# EAGLE design RH003.1 (EAGLE 7.1.0)
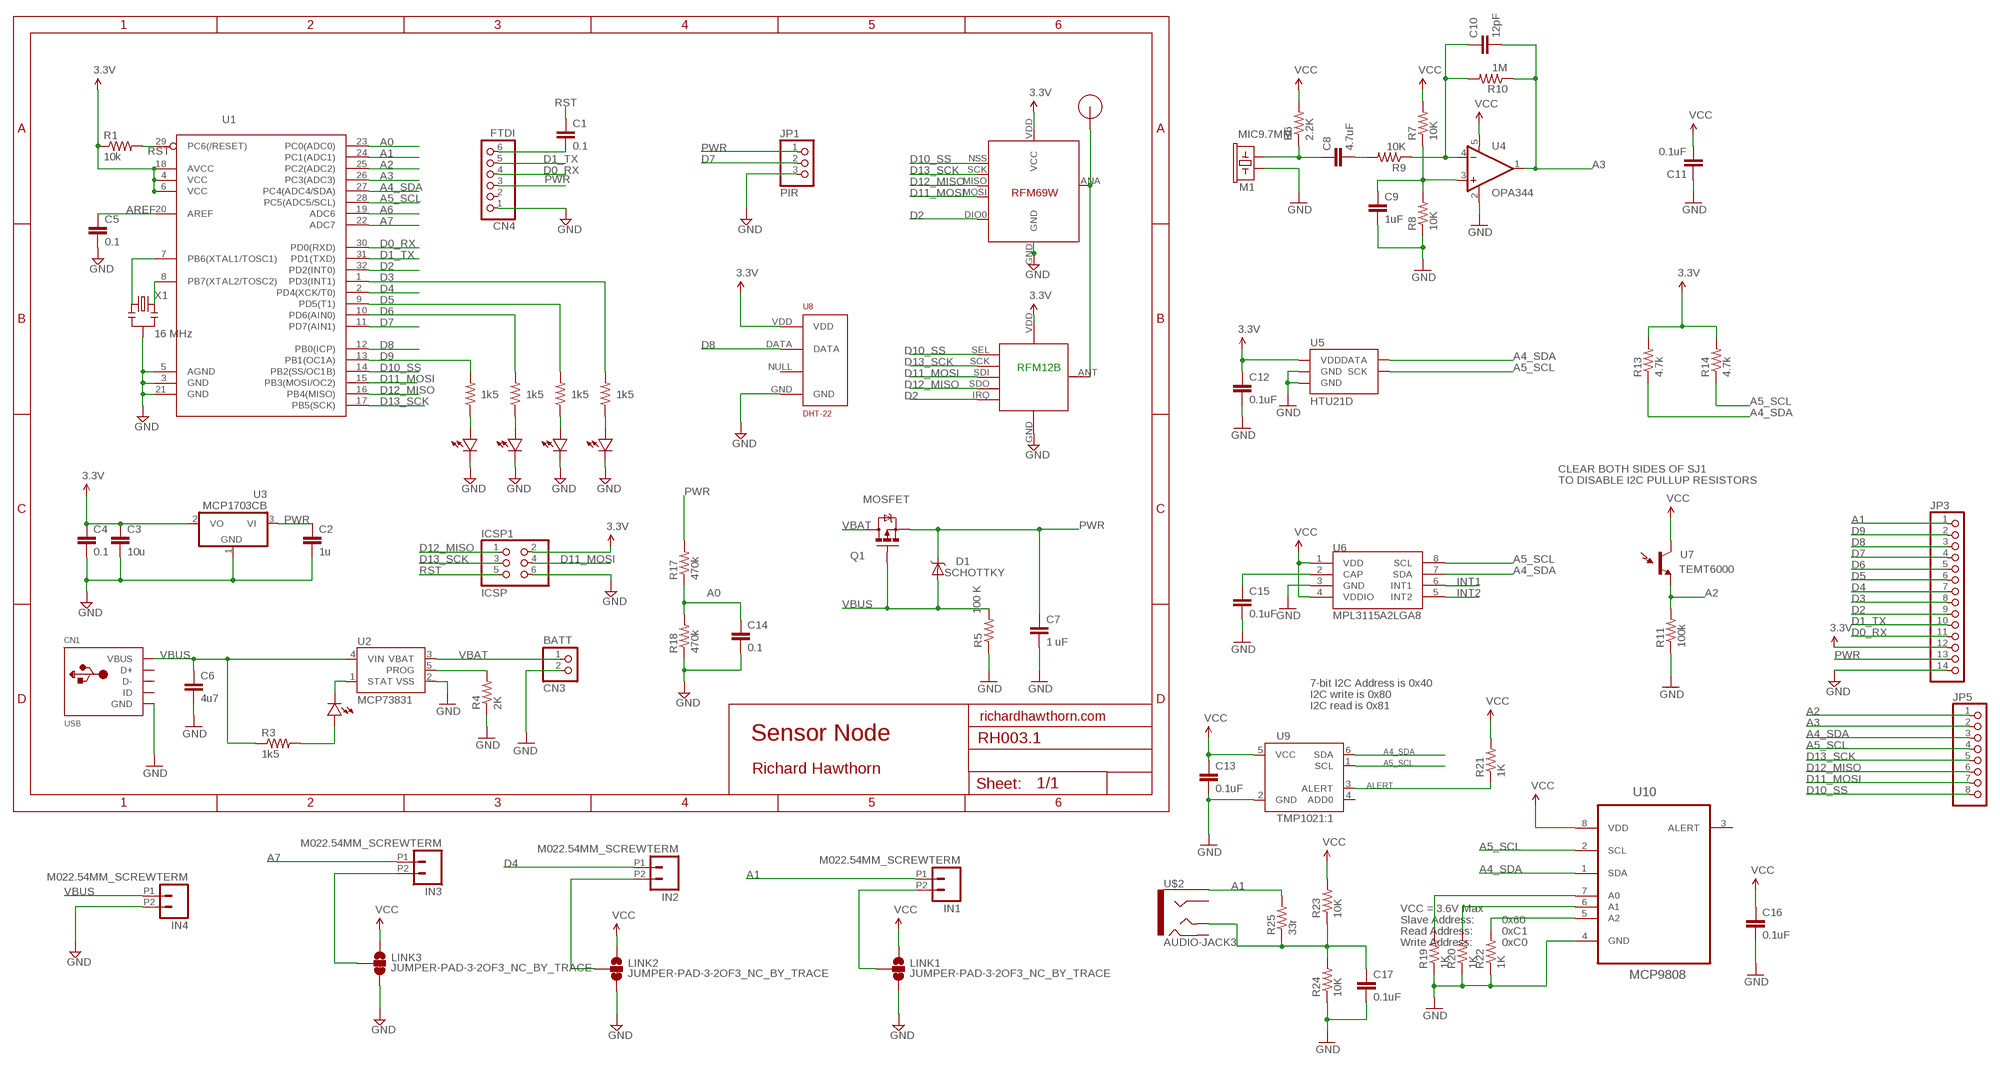
[diagram p0: schematic, sheet 1]

## Parts
C1  0.1  CAP0603-CAP  [0603-CAP]
C2  1u  CAP0603-CAP  [0603-CAP]
C3  10u  CAP0805-CAP  [0805-CAP]
C4  0.1  CAP0603-CAP  [0603-CAP]
C5  0.1  CAP0603-CAP  [0603-CAP]
C6  4u7  CAP0603-CAP  [0603-CAP]
C7  1 uF  CAP0805  [0805]
C8  4.7uF  CAP0805  [0805]
C9  1uF  CAP0805  [0805]
C10  12pF  CAP0805  [0805]
C11  0.1uF  CAP0805  [0805]
C12  0.1uF  CAP0805  [0805]
C13  0.1uF  CAP0603-CAP  [0603-CAP]
C14  0.1  CAP0603-CAP  [0603-CAP]
C15  0.1uF  CAP0805  [0805]
C16  0.1uF  CAP0603-CAP  [0603-CAP]
C17  0.1uF  CAP0603-CAP  [0603-CAP]
CN1  USB  USBMINIB  [USB-MINIB]
CN3  BATT  JST_2PIN-SMT-RA  [JST-PH-2-SMT-RA]
CN4  FTDI  PINHD-1X6  [1X06]
D1  SCHOTTKY  DIODE-SCHOTTKY_  [SMA-DIODE]
ICSP1  ICSP  PINHD-2X3  [2X03]
IN1  M022.54MM_SCREWTERM  [1X02_2.54_SCREWTERM]
IN2  M022.54MM_SCREWTERM  [1X02_2.54_SCREWTERM]
IN3  M022.54MM_SCREWTERM  [1X02_2.54_SCREWTERM]
IN4  M022.54MM_SCREWTERM  [1X02_2.54_SCREWTERM]
JP1  PIR  PINHD-1X3  [1X03]
JP3  PINHD-1X14  [1X14]
JP5  PINHD-1X8  [1X08]
LED1  LED0603  [0603-LED]
LED2  LED0603  [0603-LED]
LED3  LED0603  [0603-LED]
LED4  LED0603  [0603-LED]
LED5  LED0603  [0603-LED]
LINK1  JUMPER-PAD-3-2OF3_NC_BY_TRACE  [PAD-JUMPER-3-2OF3_NC_BY_TRACE_YES_SILK_FULL_BOX]
LINK2  JUMPER-PAD-3-2OF3_NC_BY_TRACE  [PAD-JUMPER-3-2OF3_NC_BY_TRACE_YES_SILK_FULL_BOX]
LINK3  JUMPER-PAD-3-2OF3_NC_BY_TRACE  [PAD-JUMPER-3-2OF3_NC_BY_TRACE_YES_SILK_FULL_BOX]
M1  MIC9.7MM  [MIC-9.7MM]
Q1  MOSFET  MOSFET-PCHANNELSMD  [SOT23-3]
R1  10k  RESISTOR0603-RES  [0603-RES]
R2  1k5  RESISTOR0805  [0805]
R3  1k5  RESISTOR0603-RES  [0603-RES]
R4  2K  RESISTOR0603-RES  [0603-RES]
R5  100 K  RESISTOR0805-RES  [0805]
R6  2.2K  RESISTOR0805-RES  [0805]
R7  10K  RESISTOR0805-RES  [0805]
R8  10K  RESISTOR0805-RES  [0805]
R9  10K  RESISTOR0805-RES  [0805]
R10  1M  RESISTOR0805-RES  [0805]
R11  100k  RESISTOR0603-RES  [0603-RES]
R12  1k5  RESISTOR0805  [0805]
R13  4.7k  RESISTOR0805-RES  [0805]
R14  4.7k  RESISTOR0805-RES  [0805]
R15  1k5  RESISTOR0805  [0805]
R16  1k5  RESISTOR0805  [0805]
R17  470k  RESISTOR0603-RES  [0603-RES]
R18  470k  RESISTOR0603-RES  [0603-RES]
R19  1K  RESISTOR0603-RES  [0603-RES]
R20  1K  RESISTOR0603-RES  [0603-RES]
R21  1K  RESISTOR0603-RES  [0603-RES]
R22  1K  RESISTOR0603-RES  [0603-RES]
R23  10K  RESISTOR0603-RES  [0603-RES]
R24  10K  RESISTOR0603-RES  [0603-RES]
R25  33r  RESISTOR0603-RES  [0603-RES]
RF1  RFM12B  RFM12B_MINPADS  [RFM12B-MINPADS]
RF2  RFM69  [RFM69W-MINPADS]
U1  ATMega-328  ATMEGA168/328TQFP32  [TQFP32-08]
U2  MCP73831  [SOT23-5]
U3  MCP1703CB  [SOT23]
U4  OPA344  [SOT23-5]
U5  HTU21D  HTU21DSMD  [HTU21D]
U6  MPL3115A2LGA8  [LGA8]
U7  TEMT6000  [TEMT6000-SEN]
U8  DHT-22  RHT03_DHT-22_AM2302RA  [RHT03_DHT-22/RA]
U9  TMP1021:1  [SOT563-2]
U10  MCP9808  MCP9808-E/MS  [SOP65P490X110-8N]
U$1  RFM12B_ANTENNA  [RFM12B-ANTENNA]
U$2  AUDIO-JACK3  [AUDIO-JACK-TRRS-SMD]
X1  16 MHz  RESONATORSMD  [RESONATOR-SMD]

## Nets
3.3V: C3.1 C4.1 C11.2 C12.1 C13.1 C16.1 ICSP1.2 JP3.12 LINK1.1 LINK2.1 LINK3.1 R1.1 R6.2 R7.2 R13.2 R14.2 R21.2 R23.2 RF1.VDD RF2.VDD(VCC) U1.4(VCC) U1.6(VCC) U1.18(AVCC) U3.2(VO) U4.5(V+) U5.VDD U6.1(VDD) U6.4(VDDIO) U7.COLLECTOR(C1) U8.VDD U9.5(VCC) U10.8(VDD) ; supply symbol labelled VCC
A0: C14.1 R17.1 R18.2 U1.23(PC0(ADC0))
A1: IN1.P1 JP3.1 R25.2 U1.24(PC1(ADC1)) U$2.EARTH
A2: JP5.1 R11.2 U1.25(PC2(ADC2)) U7.EMITTER(E1)
A3: C10.2 JP5.2 R10.1 U1.26(PC3(ADC3)) U4.1(OUT)
A4_SDA: JP5.3 R13.1 U1.27(PC4(ADC4/SDA)) U5.DATA U6.7(SDA) U9.6(SDA) U10.1(SDA)
A5_SCL: JP5.4 R14.1 U1.28(PC5(ADC5/SCL)) U5.SCK U6.8(SCL) U9.1(SCL) U10.2(SCL)
A6: U1.19(ADC6)
A7: IN3.P1 U1.22(ADC7)
ALERT: R21.1 U9.3(ALERT)
AREF: C5.1 U1.20(AREF)
D0_RX: CN4.4 JP3.11 U1.30(PD0(RXD))
D1_TX: CN4.5 JP3.10 U1.31(PD1(TXD))
D2: JP3.9 RF1.IRQ RF2.DIO0 U1.32(PD2(INT0))
D3: JP3.8 R16.2 U1.1(PD3(INT1))
D4: IN2.P1 JP3.7 U1.2(PD4(XCK/T0))
D5: JP3.6 R15.2 U1.9(PD5(T1))
D6: JP3.5 R12.2 U1.10(PD6(AIN0))
D7: JP1.2 JP3.4 U1.11(PD7(AIN1))
D8: JP3.3 U1.12(PB0(ICP)) U8.DATA
D9: JP3.2 R2.2 U1.13(PB1(OC1A))
D10_SS: JP5.8 RF1.SEL RF2.NSS(SEL) U1.14(PB2(SS/OC1B))
D11_MOSI: ICSP1.4 JP5.7 RF1.SDI(SDI/MOSI) RF2.MOSI U1.15(PB3(MOSI/OC2))
D12_MISO: ICSP1.1 JP5.6 RF1.SDO(SDO/MISO) RF2.MISO U1.16(PB4(MISO))
D13_SCK: ICSP1.3 JP5.5 RF1.SCK RF2.SCK U1.17(PB5(SCK))
GND [power]: C2.2 C3.2 C4.2 C5.2 C6.2 C7.2 C9.2 C11.1 C12.2 C13.2 C14.2 C15.2 C16.2 C17.2 CN1.GND CN3.2 CN4.1 ICSP1.6 IN4.P2 JP1.3 JP3.14 LED2.MINUS LED3.MINUS LED4.MINUS LED5.MINUS LINK1.3 LINK2.3 LINK3.3 M1.2 R4.1 R5.1 R8.1 R11.1 R18.1 R19.1 R20.1 R22.1 R24.1 RF1.GND RF2.GND U1.3(GND) U1.5(AGND) U1.21(GND) U2.2(VSS) U3.1(GND) U4.2(V-) U5.7(GND) U5.GND U6.3(GND) U8.GND U9.2(GND) U10.4(GND) X1.2
INT1: U6.6(INT1)
INT2: U6.5(INT2)
N$1: U1.7(PB6(XTAL1/TOSC1)) X1.1
N$2: LED2.PLUS R2.1
N$3: RF1.ANT RF2.ANA(ANT) U$1.P$1
N$4: LED1.PLUS R3.2
N$5: C8.1 M1.1 R6.1
N$6: C10.1 R9.1 R10.2 U4.4(-IN)
N$7: C8.2 R9.2
N$8: C9.1 R7.1 R8.2 U4.3(+IN)
N$9: C15.1 U6.2(CAP)
N$10: LED3.PLUS R12.1
N$11: LED4.PLUS R15.1
N$12: LED5.PLUS R16.1
N$13 [power]: IN1.P2 LINK1.2
N$14: C17.1 R23.1 R24.2 R25.1 U$2.TIP
N$15 [power]: IN2.P2 LINK2.2
N$16: R22.2 U10.5(A2)
N$17: R20.2 U10.6(A1)
N$18: R19.2 U10.7(A0)
N$19 [power]: IN3.P2 LINK3.2
N$20: C1.2 CN4.6
N$21: U1.8(PB7(XTAL2/TOSC2)) X1.3
PROG: R4.2 U2.5(PROG)
PWR [power]: C2.1 C7.1 CN4.3 D1.C JP1.1 JP3.13 Q1.2(S) R17.2 U3.3(VI)
RST: C1.1 ICSP1.5 R1.2 U1.29(PC6(/RESET))
STAT: LED1.MINUS U2.1(STAT)
VBAT: CN3.1 Q1.3(D) U2.3(VBAT)
VBUS [power]: C6.1 CN1.VBUS D1.A IN4.P1 Q1.1(G) R3.1 R5.2 U2.4(VIN)
Unconnected: CN1.D+ CN1.D- CN1.ID CN4.2 U8.NULL U9.4(ADD0) U10.3(ALERT) U$2.RING1 U$2.RING2

## Notes on the sheet
- RFM12B
- CLEAR BOTH SIDES OF SJ1
- TO DISABLE I2C PULLUP RESISTORS
- 7-bit I2C Address is 0x40
- I2C write is 0x80
- I2C read is 0x81
- richardhawthorn.com
- Sensor Node
- Richard Hawthorn
- VCC = 3.6V Max
- Slave Address: | 0x60
- Read Address: | 0xC1
- Write Address: | 0xC0

## Library data of the parts
C1-C5 C14 = LowPowerLab:CAP: Capacitor Standard 0603 ceramic capacitor, and 0.1" leaded capacitor.
C6 C8-C13 C15-C17 = SparkFun:CAP: Capacitor Standard 0603 ceramic capacitor, and 0.1" leaded capacitor.
C7 = SparkFun-Capacitors:CAP: Capacitor Standard 0603 ceramic capacitor, and 0.1" leaded capacitor.
CN1 = LowPowerLab:USB: USB Connectors USBMINIB - Surface Mount Female Mini-B USB Connector 4UConnector: 06564 By microbuilder.eu Thru-hole RA Female Mini-B USB Connector 4UConnector: 18732 By ladyada.net
CN3 = adafruit:JST_2PIN: JST 2-Pin Connectors of various flavors SMT-RA (S2B-PH-SM4) 4UConnector #17311 SMT (B2B-PH-SM4) THM-RA (S2B-PH) THM (B2B-PH)
CN4 = pinhead:PINHD-1X6: PIN HEADER
D1 = SparkFun-DiscreteSemi:DIODE-SCHOTTKY: Commonly MBRA140.
ICSP1 = pinhead:PINHD-2X3: PIN HEADER
IN1-IN4 = SparkFun-Connectors:M02: Standard 2-pin 0.1" header. Use with - straight break away headers ( PRT-00116) - right angle break away headers (PRT-00553) - swiss pins (PRT-00743) - machine pins (PRT-00117) - female headers (PRT-00115) Molex polarized connector foot print use with: PRT-08233 with associated crimp pins and housings. 2.54_SCREWTERM for use with PRT-10571. 3.5mm Screw Terminal footprints for PRT-08084 5mm Screw Terminal footprints for use with PRT-08432
JP1 = pinhead:PINHD-1X3: PIN HEADER
JP3 = pinhead:PINHD-1X14: PIN HEADER
JP5 = pinhead:PINHD-1X8: PIN HEADER
LED1-LED5 = LowPowerLab:LED
LINK1-LINK3 = SparkFun-Passives:JUMPER-PAD-3-2OF3_NC_BY_TRACE
M1 = SparkFun:MIC: Microphone Omni-directional electret microphone. 9.7mm standard diameter.
Q1 = SparkFun-DiscreteSemi:MOSFET-PCHANNEL: Generic PMOSFET
R1-R4 R12 R15-R18 = LowPowerLab:RESISTOR: Resistor Basic schematic elements and footprints for 0603, 1206, and PTH resistors.
R5 = SparkFun-Resistors:RESISTOR: Resistor Basic schematic elements and footprints for 0603, 1206, and PTH resistors.
R6-R11 R13 R14 R19-R25 = SparkFun:RESISTOR: Resistor Basic schematic elements and footprints for 0603, 1206, and PTH resistors.
RF1 = LowPowerLab:RFM12B_MINPADS
RF2 = LowPowerLab:RFM69
U1 = LowPowerLab:ATMEGA168/328: Atmel 32-pin 8-bit micro, 16k flash.
U2 = SparkFun:MCP73831: Microchip's MCP73831 Miniature single cell, fully integrated Li-Ion, Li-polymer charge management controller http://ww1.microchip.com/downloads/en/DeviceDoc/21984a.pdf
U3 = linear:MCP1703: 250 mA, 16V, Low Quiescent Current LDO Regulator Source: http://ww1.microchip.com/downloads/en/DeviceDoc/22049b.pdf
U4 = SparkFun:OPA344
U5 = SparkFun-Sensors:HTU21D
U6 = SparkFun-Sensors:MPL3115A2: Altimeter/Pressure Sensor, I2C, 1.95V-3.6V supply, 50 to 110kPa
U7 = SparkFun:TEMT6000: Ambient Light Sensor Simple light detection sensor. Output varies with light intensity input. Spark Fun Electronics SKU : COM-08348
U8 = RHT03_DHT-22_AM2302:RHT03_DHT-22_AM2302: RHT03 / DHT-22 / AM2302 Packages and symbol for the RHT03 / DHT-22 relative humidity and temperature sensor. Note: The AM2302 is a wired version of the DHT-22 which typically requires less clearance and is thus provided as a separate package.; PROD_ID: SEN-10167
U9 = SparkFun-Sensors:TMP102: I2C degC temp sensor
U10 = Richard1:MCP9808-E/MS: Digital Temperature Sensor,MSOP-8; MPN: MCP9808-E/MS; OC_FARNELL: 2080523; OC_NEWARK: 89T8871; PACKAGE: MSOP-8; SUPPLIER: MICROCHIP
U$1 = LowPowerLab:RFM12B_ANTENNA
U$2 = SparkFun-Connectors:AUDIO-JACK3: Audio jack - 3.5mm TRRS variety - two rings.
X1 = SparkFun:RESONATOR: Resonator Small SMD resonator. This is the itty bitty 10/20MHz resonators with built in caps. CSTCE10M0G55 and CSTCE20M0V53. Footprint has been reviewed closely but hasn't been tested yet.

## Net classes
1 power: width 0.381 mm, clearance 0.254 mm

## Board
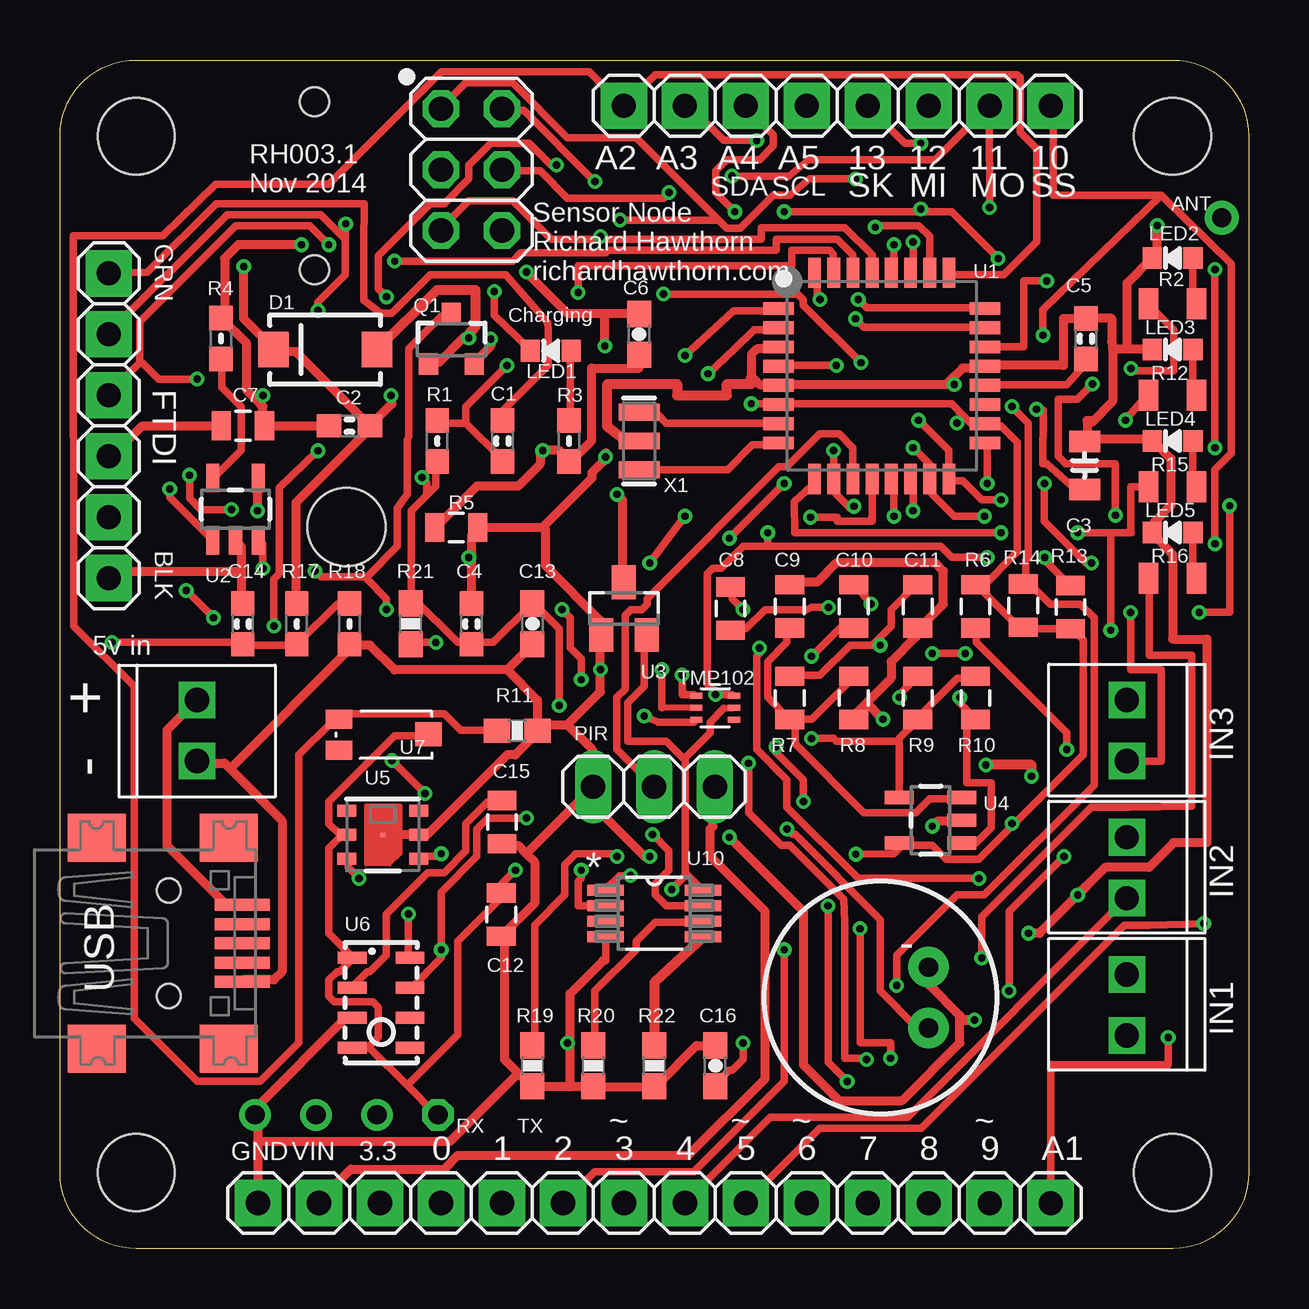
[diagram p1: board, top side]
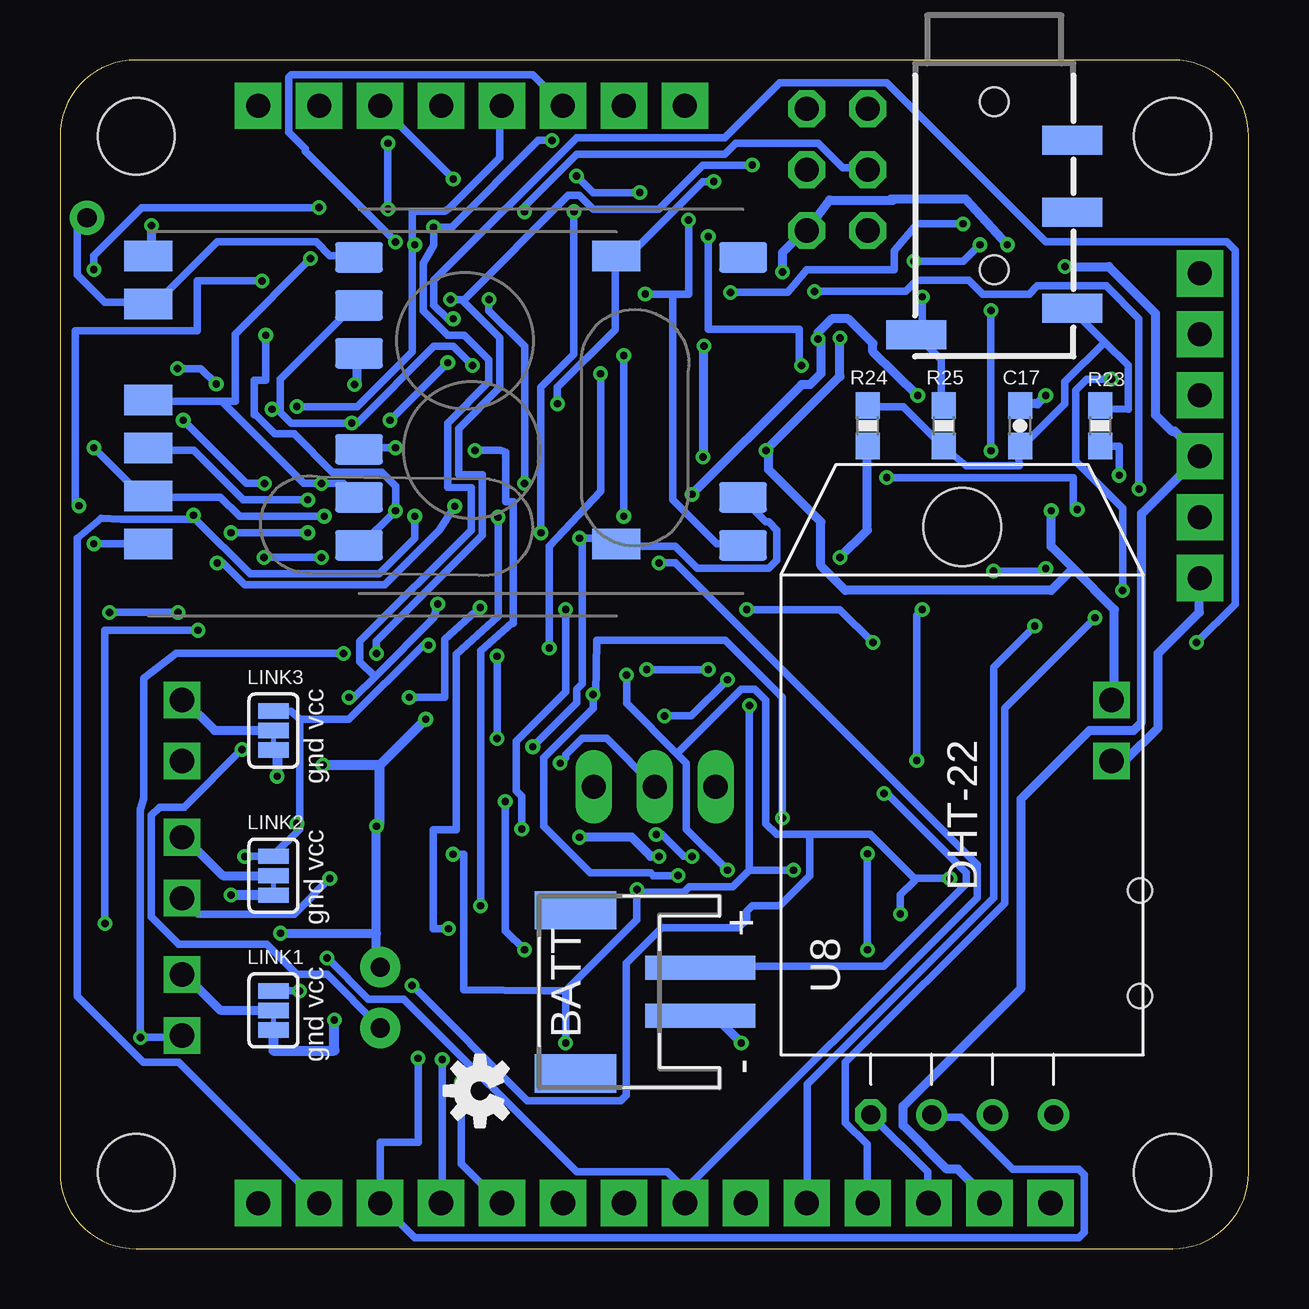
[diagram p2: board, bottom side, seen from below]

Size 49.53 x 49.53 mm. Coordinates in mm from the lower left corner, seen from the top.
Outline: 0,3.17 0,46.35 arc-90 3.17,49.53 46.35,49.53 arc-90 49.53,46.35 49.53,3.17 arc-90 46.35,0 3.17,0 arc-90 0,3.17
Copper layers (1*16): Top 0.035mm / dielectric 1.5mm / Bottom 0.035mm
Design rules "ITEADstudio_DRC *": minimum track width 12mil, minimum drill 12mil, track to track 6mil, track to pad 6mil, pad to pad 6mil, via to via 6mil, smd to smd 0mil, copper to edge 10mil, drill to drill 10mil, minimum pad ring 10mil, minimum via ring 6mil, stop-mask expansion 2mil, vias tented up to drill 100mil, thermal gap 15mil
Holes 3.2 mm at 3.17,3.17 46.35,3.17 3.17,46.35 46.35,46.35
tKeepout: area 0,0 to 5.7,5.7; area 43.8,0 to 49.5,5.7; area 43.8,43.8 to 49.5,49.5; area 0,43.8 to 5.7,49.5
bKeepout: area 0,43.8 to 5.7,49.5; area 43.8,43.8 to 49.5,49.5; area 43.8,0 to 49.5,5.7; area 0,0 to 5.7,5.7
tRestrict: area 24.3,8.9 to 29.1,12.8; area 5.8,16.9 to 6.9,18.5; area 5.2,9.7 to 6.7,10.4
bRestrict: area 27.4,17.7 to 29.2,18.7; area 21.1,13.8 to 22.9,14.9; area 21.6,12.6 to 22.1,13.2; area 20.7,12.6 to 21.2,13.2; area 20.2,12.8 to 20.7,13.5; area 20.1,13.4 to 20.6,14; area 26.5,18.9 to 27.1,19.5; area 26.5,17.9 to 27.1,18.5; area 27.5,19.1 to 28,19.8; area 27.9,18.8 to 29.1,19.6

### Footprints (pad centres in the part's own frame; a part is rotated, then mirrored left to right if it is on the bottom)
0603-CAP = smd 1.016 x 0.965: 1 -0.85,0; 2 0.85,0
0805-CAP = smd 0.902 x 1.3: 1 -1,0; 2 1,0
0603-CAP' = smd 1.1 x 1: 1 -0.85,0; 2 0.85,0
0805 = smd 0.8 x 1.2: 1 -0.9,0; 2 0.9,0
USB-MINIB = smd 0.5 x 2.308: D+ 0,4.064; D- -0.8,4.064; GND 1.6,4.064; ID 0.8,4.064; VBUS -1.6,4.064 | smd 2 x 2.4: GND1 -4.4,-2; GND2 -4.4,3.5; GND3 4.4,3.5; GND4 4.4,-2 | hole 1: -2.2,1; 2.2,1
JST-PH-2-SMT-RA = smd 1 x 4.6: 1 1,-3.7; 2 -1,-3.7 | smd 1.6 x 3.4: NC1 -3.4,1.5; NC2 3.4,1.5
1X06 = drill 1 pad 1.93 square: 1 -6.35,0; 2 -3.81,0; 3 -1.27,0; 4 1.27,0; 5 3.81,0; 6 6.35,0
SMA-DIODE = smd 1.27 x 1.47: A -2.15,0; C 2.15,0
2X03 = drill 1.016 octagon: 1 -2.54,-1.27; 2 -2.54,1.27; 3 0,-1.27; 4 0,1.27; 5 2.54,-1.27; 6 2.54,1.27
1X02_2.54_SCREWTERM = drill 1.016 square: P1 2.54,0; P2 0,0
1X03 = drill 1.016 long: 1 -2.54,0; 2 0,0; 3 2.54,0
1X14 = drill 1 pad 1.93 square: 1 -16.51,0; 2 -13.97,0; 3 -11.43,0 | drill 1.016 pad 1.93 square: 4 -8.89,0; 5 -6.35,0; 6 -3.81,0; 7 -1.27,0; 8 1.27,0; 9 3.81,0; 10 6.35,0; 11 8.89,0; 12 11.43,0; 13 13.97,0; 14 16.51,0
1X08 = drill 1 pad 1.93 square: 1 -8.89,0; 2 -6.35,0; 3 -3.81,0; 4 -1.27,0; 5 1.27,0; 6 3.81,0; 7 6.35,0; 8 8.89,0
0603-LED = smd 0.8 x 0.9: MINUS -0.85,0; PLUS 0.85,0
PAD-JUMPER-3-2OF3_NC_BY_TRACE_YES_SILK_FULL_BOX = smd 0.635 x 1.27: 1 -0.813,0; 2 0,0; 3 0.813,0
MIC-9.7MM = drill 0.8 pad 1.676: 1 -2,1.27; 2 -2,-1.27
SOT23-3 = smd 0.8 x 0.9: 1 -0.95,-1; 2 0.95,-1; 3 0,1.1
0603-RES = smd 1.016 x 0.965: 1 -0.85,0; 2 0.85,0
0805' = smd 0.8 x 1.3: 1 -1,0; 2 1,0
0603-RES' = smd 1.1 x 1: 1 -0.85,0; 2 0.85,0
RFM12B-MINPADS = smd 2 x 1.27: ANT 8,-6; GND 8,-2; IRQ -8,4; SCK 8,4; SDI 8,2; SDI1 -8.002,-6.001; SDO -8,6; SEL 8,6; VDD 8,-4
RFM69W-MINPADS = smd 2 x 1.27: ANA 8,-5; DIO0 -11.5,5; GND 8,-7; MISO 8,1; MOSI 8,3; NSS 8,5; SCK 8,-1; VDD -11.5,-7
TQFP32-08 = smd 1.27 x 0.533: 1 -4.293,2.8; 2 -4.293,2; 3 -4.293,1.2; 4 -4.293,0.4; 5 -4.293,-0.4; 6 -4.293,-1.2; 7 -4.293,-2; 8 -4.293,-2.8; 17 4.293,-2.8; 18 4.293,-2; 19 4.293,-1.2; 20 4.293,-0.4; 21 4.293,0.4; 22 4.293,1.2; 23 4.293,2; 24 4.293,2.8 | smd 0.533 x 1.27: 9 -2.8,-4.293; 10 -2,-4.293; 11 -1.2,-4.293; 12 -0.4,-4.293; 13 0.4,-4.293; 14 1.2,-4.293; 15 2,-4.293; 16 2.8,-4.293; 25 2.8,4.293; 26 2,4.293; 27 1.2,4.293; 28 0.4,4.293; 29 -0.4,4.293; 30 -1.2,4.293; 31 -2,4.293; 32 -2.8,4.293
SOT23-5 = smd 0.55 x 1.2: 1 -0.95,-1.3; 2 0,-1.3; 3 0.95,-1.3; 4 0.95,1.3; 5 -0.95,1.3
SOT23 = smd 1 x 1.4: 1 -0.95,-1.1; 2 0.95,-1.1; 3 0,1.1
HTU21D = smd 0.2 x 0.2: 7 0,0 | smd 0.8 x 0.5: DATA 1.5,-1; GND 1.5,0; NC@1 -1.5,1; NC@6 1.5,1; SCK -1.5,-1; VDD -1.5,0
LGA8 = smd 1.2 x 0.5: 1 -1.2,1.875; 2 -1.2,0.625; 3 -1.2,-0.625; 4 -1.2,-1.875; 5 1.2,-1.875; 6 1.2,-0.625; 7 1.2,0.625; 8 1.2,1.875
TEMT6000-SEN = smd 1.1 x 0.8: BASE -1.87,-0.65; EMITTER -1.87,0.65 | smd 1.1 x 1: COLLECTOR 1.86,0.01
RHT03_DHT-22/RA = drill 0.8: DATA -1.27,0; GND 3.81,0; NULL 1.27,0 | drill 0.8 octagon: VDD -3.81,0 | hole 3.25: 0,24.5
SOT563-2 = smd 0.508 x 0.249: 1 -0.8,0.498; 2 -0.8,0.003; 3 -0.8,-0.506; 4 0.776,-0.506; 5 0.776,0.003; 6 0.776,0.498
SOP65P490X110-8N = smd 1.524 x 0.457: 1 -2.032,0.965; 2 -2.032,0.33; 3 -2.032,-0.33; 4 -2.032,-0.965; 5 2.032,-0.965; 6 2.032,-0.33; 7 2.032,0.33; 8 2.032,0.965
RFM12B-ANTENNA = drill 0.8 pad 1.422: P$1 0,0
AUDIO-JACK-TRRS-SMD = smd 1.2 x 2.5: EARTH 11.3,-3.25; RING1 6.2,3.25; RING2 3.2,3.25; TIP 10.2,3.25 | hole 1.2: 1.6,0; 8.6,0
RESONATOR-SMD = smd 0.7 x 1.7: 1 -1.2,0; 2 0,0; 3 1.2,0

### Placement (x,y rotation side)
C1  18.44,33.66 90 top
C2  12.06,34.29 180 top
C3  42.7,32.64 90 top
C4  17.14,26.04 90 top
C5  42.75,37.92 90 top
C6  4u7  [0603-CAP']  24.13,38.1 90 top
C7  7.62,34.29 0 top
C8  27.94,26.67 270 top
C9  30.4,26.76 90 top
C10  33.07,26.76 90 top
C11  35.73,26.76 90 top
C12  18.38,13.92 270 top
C13  0.1uF  [0603-CAP']  19.68,26.04 270 top
C14  7.62,26.04 90 top
C15  18.41,17.78 270 top
C16  0.1uF  [0603-CAP']  27.3,7.62 90 top
C17  0.1uF  [0603-CAP']  9.53,34.29 90 bottom
CN1  3.53,12.73 270 top
CN3  26.55,10.7 90 bottom
CN4  2.03,34.29 90 top
D1  11.05,37.47 180 top
ICSP1  17.14,44.96 270 top
IN1  44.45,11.43 270 top
IN2  44.45,17.14 270 top
IN3  44.45,22.86 270 top
IN4  5.71,20.32 90 top
JP1  24.75,19.25 180 top
JP3  24.77,1.91 180 top
JP5  32.38,47.62 0 top
LED1  20.45,37.41 0 top
LED2  46.35,41.27 0 top
LED3  46.35,37.47 0 top
LED4  46.35,33.66 0 top
LED5  46.35,29.84 0 top
LINK1  40.64,9.93 270 bottom
LINK2  40.64,15.54 270 bottom
LINK3  40.64,21.59 270 bottom
M1  34.19,10.46 180 top
Q1  16.31,37.87 0 top
R1  15.72,33.66 90 top
R2  1k5  [0805']  46.35,39.37 180 top
R3  21.21,33.66 90 top
R4  6.71,37.92 270 top
R5  16.51,30.05 180 top
R6  38.15,26.76 90 top
R7  30.4,22.95 90 top
R8  33.07,22.95 90 top
R9  35.73,22.95 90 top
R10  38.15,22.95 90 top
R11  100k  [0603-RES']  19.05,21.59 180 top
R12  1k5  [0805']  46.35,35.56 180 top
R13  42.1,26.73 270 top
R14  40.13,26.8 270 top
R15  1k5  [0805']  46.35,31.75 180 top
R16  1k5  [0805']  46.35,27.94 180 top
R17  9.87,26.04 90 top
R18  12.06,26.04 90 top
R19  1K  [0603-RES']  19.68,7.62 90 top
R20  1K  [0603-RES']  22.23,7.62 90 top
R21  1K  [0603-RES']  14.61,26.04 90 top
R22  1K  [0603-RES']  24.77,7.62 90 top
R23  10K  [0603-RES']  6.19,34.29 270 bottom
R24  10K  [0603-RES']  15.88,34.29 90 bottom
R25  33r  [0603-RES']  12.7,34.29 90 bottom
RF1  29.07,35.31 180 bottom
RF2  37.85,34.37 180 bottom
U1  34.24,36.37 0 top
U2  7.32,30.81 0 top
U3  23.5,26.67 0 top
U4  36.27,17.85 90 top
U5  13.45,17.24 0 top
U6  13.38,10.25 0 top
U7  13.49,21.42 0 top
U8  11.94,5.58 0 bottom
U9  27.3,22.54 0 top
U10  24.77,13.97 0 top
U$1  48.41,42.96 0 top
U$2  10.61,49.38 270 bottom
U$3  [OSHW-LOGO-S]  32.03,6.58 90 bottom
X1  24.13,33.66 270 top

### Tracks (layer width: path | path; a pad name or v marks a point on that pad's centre or on a via)
3.3V  (via drill 0.3)
  Top 0.254: 27.66,22.52 28,22.52 U9.5
  Top 0.305: U7.COLLECTOR 15.32,21.37 13.95,21.37 11.2,18.63 11.2,17.72 11.66,17.26 U5.VDD 11.89,17.14 11.66,17.14 11.2,16.69 11.2,13.14 12.12,12.23 U6.1 12.12,12 11.66,11.54 11.54,11.54 11.2,11.2 11.2,10.52 11.43,10.29 13.03,10.29 13.26,10.06 13.26,8.8 12.92,8.46 12.92,8.34 | 12.92,8.34 12.23,8.34 U6.4 | 14.46,6.8 15.66,5.6 U8.VDD | 14.46,6.8 12.92,8.34 | 14.46,6.8 16.57,8.91 16.57,12.8 18.29,14.52 18.29,14.74 C12.1 18.4,14.97 18.4,15.2 v18.97,15.77 | 15.28,31.39 14.63,30.75 14.63,26.98 R21.2 14.74,27.09 16.57,25.26 17.03,25.26 C4.1 17.14,25.26 18.06,25.26 19.66,26.86 C13.1 19.77,26.86 20.8,25.83 v20.8,22.63 | 15.28,31.39 15.66,31.77 15.66,32.8 R1.1 | 27.66,22.52 27.09,21.95 27.09,21.49 26.06,20.46 | 26.06,15.66 26.06,20.46 | 26.06,15.66 26.75,14.97 U10.8 | v28.46,8.57 28.46,7.89 28,7.43 27.89,7.43 27.32,6.86 C16.1 | v25.49,14.97 26.06,15.54 26.06,15.66 | U3.2 24.35,25.49 24.35,23.43 23.66,22.75 23.66,21.14 25.26,21.14 25.95,20.46 26.06,20.46 | 34,25.32 34.63,25.95 34.63,26.63 35.66,27.66 C11.2 | 34,25.32 33.83,25.15 32.92,25.15 31.66,23.89 30.4,23.89 R7.2 | v39.55,10.74 39.55,14.06 v41.83,16.34 | v34.18,25.15 34,25.32 | v32.35,36.8 29.95,36.8 U1.4 | v40.69,34.98 40.8,35.02 40.96,34.94 40.96,32.7 41.12,32.7 42.07,31.84 42.63,31.84 42.63,31.66 C3.1 | 39.72,17.66 42.63,20.57 42.63,25.38 42.18,25.83 R13.2 41.95,25.83 40.23,25.83 R14.2 40.01,25.83 38.18,27.66 R6.2 38.41,27.55 39.89,29.03 39.89,33.6 39.2,34.29 38.63,34.29 U1.18 38.41,34.4 37.95,34.4 37.66,34.69 | 39.72,17.66 38.29,16.23 36.92,16.23 36.35,16.8 34.98,16.8 U4.5 34.98,16.69 34.75,16.46 v33.16,16.43
  Top 0.305: 37.66,34.69 37.15,35.2 29.95,35.2 U1.6 29.83,35.2 v28.8,35.2 | v22.29,44.46 19.32,47.43 18.52,47.43 ICSP1.2 | 37.66,34.69 v37.38,34.4 | v39.66,17.72 39.72,17.66 | v5.4,32.23 5.4,31.27 5.87,30.8 v7.14,30.8 | v15.08,32.13 15.28,31.91 15.28,31.39
  Bottom 0.305: JP3.12 13.37,1.94 13.37,3.2 15.66,5.49 U8.VDD | 28.46,10.74 v28.46,8.57 | 28.46,10.74 25.49,13.72 v25.49,14.97 25.38,14.86 23.55,14.86 23.32,15.09 21.49,15.09 20.8,15.77 | 20.8,15.77 v20.8,22.63 | 20.8,15.77 v18.97,15.77 | v39.55,10.74 40.58,10.74 LINK1.1 | v41.83,16.34 40.69,16.34 LINK2.1 40.58,16.46 39.55,17.49 39.55,17.72 | LINK3.1 39.89,22.4 39.55,22.06 | 39.55,17.72 39.55,22.06 | v34.18,25.15 34.4,25.15 37.49,22.06 39.55,22.06 | v32.35,36.8 33.15,37.6 33.95,37.6 37.15,34.4 v37.38,34.4 39.89,34.4 40.35,34.86 40.35,34.98 | 40.35,34.98 40.35,36.23 37.38,39.2 37.15,39.2 RF1.VDD | 40.35,34.98 v40.69,34.98 | 26.4,41.38 RF2.VDD | v28.8,35.2 28.8,35.89 26.4,38.29 26.4,41.26 RF2.VDD | v22.29,44.46 22.75,44.46 25.72,41.49 26.29,41.49 RF2.VDD | v39.66,17.72 39.55,17.72 | 28.46,10.74 29.38,10.74 32.7,10.79 32.7,16.43 v33.16,16.43 | R23.2 5.4,33.44 v5.4,32.23 | v7.14,30.8 7.3,30.8 7.3,32.13 v15.08,32.13
A0  (via drill 0.3)
  Top 0.305: R18.2 12,26.86 11.54,26.86 9.94,25.26 R17.1 9.83,25.15 7.66,25.15 C14.1 7.54,25.26 v2.17,25.26 | v33.15,38.75 33.49,38.41 38.52,38.41 U1.23
  Bottom 0.305: v33.15,38.75 33.38,38.75 33.95,39.32 33.95,40.35 28,46.29 21.83,46.29 19.55,48.58 15.09,48.58 8.46,41.95 0.91,41.95 0.57,41.6 0.57,26.86 v2.17,25.26
A1  (via drill 0.3)
  Top 0.305: v46.18,8.8 46.18,7.66 41.27,7.66 JP3.1 | v33.26,39.55 33.6,39.2 38.52,39.2 U1.24 | v20.69,45.15 20.46,45.15 19.55,46.06 17.95,46.06 17.03,45.15 17.03,44.58 16,43.55 15.43,43.55 13.26,41.38 13.26,40.01 v13.6,39.66 | v36.35,24.8 v37.72,24.8
  Bottom 0.305: R25.2 12.8,35.2 12.8,37.03 13.83,38.06 U$2.EARTH 13.83,38.18 13.6,38.41 v13.6,39.66 | 32.69,39.55 v33.26,39.55 | 32.69,39.55 28.35,43.89 27.89,43.89 27.32,43.32 24.57,43.32 22.75,45.15 v20.69,45.15 | v37.72,24.8 44.69,24.8 46.04,23.77 46.04,18.76 46.18,18.29 v46.18,8.8 44.45,8.8 IN1.P1 | v36.35,24.8 36.35,25.31 31.94,29.72 31.94,32.24 32.92,32.27 32.92,34.18 31.2,35.89 31.2,37.95 32.69,39.43 32.69,39.55
A2
  Top 0.305: R11.2 18.17,21.6 16.69,21.6 16,22.29 11.77,22.29 11.66,22.17 U7.EMITTER 11.54,21.95 11.32,21.95 9.94,20.57 9.94,8.57 8.34,6.97 5.71,6.97 3.09,9.6 3.09,23.43 0.57,25.95 0.56,41.6 0.56,42.22 4.29,42.22 6.49,44.35 11.2,44.35 15.89,49.03 22.06,49.03 23.43,47.66 JP5.1 23.55,47.66 24.8,48.92 39.89,48.92 40.01,48.81 40.01,46.52 40.69,45.83 40.69,41.95 39.32,40.58 37.15,40.58 U1.25
A3  (via drill 0.3)
  Top 0.305: U4.1 37.6,16.92 38.18,16.92 38.79,17.53 38.79,19.43 37.78,19.43 37.78,21.91 38.18,21.95 R10.1 38.06,22.17 37.49,22.75 v37.49,22.97 | v33.79,26.86 33.15,27.66 C10.2 | v33.97,42.56 34.2,42.63 35.78,42.63 36.23,42.18 36.23,40.69 U1.26 | v29.03,46.18 27.66,46.18 26.29,47.55 26.06,47.55 JP5.2
  Bottom 0.305: v33.79,26.86 33.95,26.29 36.41,23.83 | 36.41,23.83 37.26,22.97 v37.49,22.97 | 36.41,23.83 37.03,24.46 37.03,25.31 32.4,29.95 32.4,31.7 33.38,31.73 33.38,34.4 31.66,36.12 31.66,37.03 32.69,38.06 33.38,38.06 34.4,39.09 34.4,41.05 33.97,41.81 v33.97,42.56 33.22,42.56 29.6,46.18 v29.03,46.18
A4_SDA  (via drill 0.3)
  Top 0.254: 28,23.09 U9.6
  Top 0.305: v35.55,41.95 35.55,40.69 U1.27 | v15.89,16.46 15.77,16.34 14.97,16.34 U5.DATA | U6.7 14.63,10.86 15.89,12.12 v15.89,12.46 15.89,14.86 17.37,16.34 17.37,17.49 17.83,17.95 v19.43,17.95 | 28,23.09 v27.32,23.09 27.32,23.2 26.98,23.55 26.98,28.12 27.2,28.35 27.55,28.35 28.46,29.26 29.49,29.26 | v23.77,15.54 23.32,15.54 22.75,14.97 U10.1 | v41.03,28.8 41.03,28.69 42.06,27.66 R13.1 | v38.63,28.8 37.15,28.8 36.69,29.26 29.49,29.26 | v28.12,43.2 27.32,44.01 27.32,44.92 27.77,45.38 29.15,45.38 29.72,45.95 29.72,46.41 28.57,47.55 JP5.3 | 29.49,29.26 v29.49,29.83
  Bottom 0.305: v35.55,41.95 39.32,45.72 39.32,45.83 40.01,46.52 40.01,48.81 39.89,48.92 29.83,48.92 28.57,47.66 JP5.3 | v15.89,12.46 v15.89,16.46 | v23.77,15.54 24.8,15.54 24.92,15.66 27.43,15.66 29.38,17.6 29.38,20.46 27.32,22.52 v27.32,23.09 27.2,23.09 27.16,25.35 21.81,25.35 19.43,22.97 v19.43,17.95 | v38.63,28.8 v41.03,28.8 | v28.12,43.2 28.12,37.26 29.49,35.89 v29.49,29.83
A5_SCL  (via drill 0.3)
  Top 0.254: 26.4,23.09 U9.1
  Top 0.305: 26.4,23.09 25.92,23.09 v25.92,23.9 | v21.72,15.77 21.72,15.43 21.6,15.32 21.6,14.63 21.59,14.63 21.59,14.29 22.73,14.29 U10.2 | v12.46,15.43 12,15.89 12,16.23 U5.SCK | v14.52,13.95 14.52,12.23 U6.8 | v39.66,35.09 40.35,34.4 40.35,28.8 40.23,28.69 40.23,27.77 R14.1 40.35,27.77 41.26,26.86 42.52,26.86 43.09,26.29 43.09,19.32 38.52,14.74 37.38,14.74 34.86,12.23 v34.86,10.97 | v34.75,41.83 34.75,40.69 U1.28
  Bottom 0.305: v25.92,23.9 25.92,22.72 23.83,20.63 | 23.83,20.63 23.43,20.23 23.43,17.49 v21.72,15.77 | 13.95,15.43 v12.46,15.43 | 13.95,15.43 15.77,17.26 18.29,17.26 | 18.29,17.26 19.66,17.26 20.12,17.72 20.12,22.86 20.57,23.32 21.14,23.32 23.83,20.63 | v14.52,13.95 14.52,14.74 13.95,15.32 13.95,15.43 | v39.66,35.09 37.15,35.09 34.86,37.38 34.86,41.83 | 34.86,41.83 34.86,43.22 33.5,43.22 33.34,43.34 31.2,45.45 31.2,47.55 JP5.4 | v34.75,41.83 34.86,41.83 | 18.29,17.26 18.29,15.54 19.55,14.29 20.69,14.29 20.92,14.06 20.92,13.72 21.26,13.37 24.46,13.37 25.95,11.89 25.95,6.4 26.18,6.17 30.06,6.17 v34.86,10.97
A7  (via drill 0.3)
  Top 0.305: U1.22 40.16,37.57 40.16,40.32 v41.12,40.32 | v48.74,30.96 48.74,26.51 v47.47,26.51 | IN3.P1 45.88,20.32 45.88,24.13 44.61,24.13 v44.61,26.51
  Bottom 0.305: v41.12,40.32 43.81,40.32 43.81,38.26 48.9,38.26 48.9,30.96 v48.74,30.96 | v44.61,26.51 v47.47,26.51
ALERT  (via drill 0.3)
  Top 0.254: 26.4,21.95 U9.3
  Top 0.305: 26.4,21.95 24.92,21.95 v24.35,22.2 | v21.72,23.71 21.72,24.57 21.26,25.03 21.26,26.29 v20.92,26.63 | v15.66,25.26 14.63,25.26 R21.1
  Bottom 0.305: v24.35,22.2 23.23,22.2 v21.72,23.71 | v20.92,26.63 17.03,26.63 v15.66,25.26
AREF
  Top 0.305: C5.1 42.7,37.07 42.7,36.83 41.95,36.01 38.63,36.01 U1.20
D0_RX  (via drill 0.3)
  Top 0.305: v13.95,41.15 18.86,41.15 19.2,41.49 22.75,41.49 22.86,41.6 29.84,41.6 29.84,42.07 32.38,42.07 33.03,41.42 33.03,40.69 U1.30 | v11.2,41.83 10.4,42.63 7.32,42.63 3.31,38.63 3.31,36.92 | 3.31,36.92 2.06,35.66 CN4.4 | v5.26,27.43 v6.4,26.29 | v5.71,36.23 4.12,36.23 3.43,36.92 3.31,36.92
  Bottom 0.305: v13.95,41.15 11.89,41.15 v11.2,41.83 | v6.4,26.29 10.17,22.52 10.17,14.4 16.8,7.77 16.8,5.26 15.89,4.34 15.89,1.94 JP3.11 | v5.26,27.43 5.26,30.86 7.2,32.8 7.2,35.78 6.74,36.23 v5.71,36.23
D1_TX  (via drill 0.3)
  Top 0.305: v8.91,25.95 8.91,27.89 9.14,28.12 9.14,31.71 v10.74,33.25 | v10.74,39.09 10.74,39.43 11.89,40.58 11.89,42.06 | 11.89,42.06 10.86,43.09 6.97,43.09 2.06,38.18 CN4.5 | U1.31 32.23,40.66 32.23,41.43 32.07,41.6 30.48,41.6 30.48,40.96 21.59,40.96 v21.59,39.85 | v11.91,42.7 11.89,42.7 11.89,42.06
  Bottom 0.305: v8.91,25.95 10.63,24.23 10.63,14.63 18.4,6.86 18.4,1.94 JP3.10 | v10.74,39.09 v10.74,33.25 | v21.59,39.85 19.21,39.85 18.41,40.8 14.76,40.8 14.76,41.59 13.81,42.7 v11.91,42.7
D2  (via drill 0.3)
  Top 0.305: v31.66,39.55 31.55,39.66 31.55,40.58 U1.32 | v27.89,29.6 v30.18,31.89 | v29.83,20.92 29.83,20.69 30.98,19.55 v30.98,18.63 | v30.18,12.46 30.18,6.97 26.4,3.2 22.29,3.2 21.03,1.94 JP3.9
  Bottom 0.305: v31.66,39.55 31.66,39.09 30.18,37.6 v30.18,31.89 | RF1.IRQ 21.03,31.2 20.12,30.29 20,30.29 19.66,29.95 19.66,28.69 20,28.35 22.97,28.35 23.89,29.26 26.29,29.26 RF2.DIO0 26.4,29.38 26.63,29.6 v27.89,29.6 27.77,29.49 27.77,23.55 28,23.32 28,22.75 v29.83,20.92 | v30.98,18.63 30.98,13.26 v30.18,12.46
D3  (via drill 0.3)
  Top 0.305: v26.04,37.21 28.08,39.09 29.95,39.09 U1.1 | v24.57,28.57 v26.04,30.52 | v38.41,12.12 38.41,13.83 42.98,18.4 44.58,18.4 47.15,18.43 47.15,24.73 45.38,24.73 45.38,27.89 R16.2
  Bottom 0.305: v26.04,30.52 v26.04,37.21 | v24.57,28.57 23.89,28.57 11.32,16 11.32,14.63 23.43,2.52 23.43,1.94 JP3.8 23.55,2.52 24.23,3.2 28,3.2 35.2,10.4 36.69,10.4 v38.41,12.12
D4  (via drill 0.3)
  Top 0.305: v27.01,36.45 28.12,37.49 28.92,38.29 29.95,38.29 U1.2 | v29.15,25.03 29.15,24.8 29.03,24.69 29.03,20.8 30.29,19.55 30.29,18.4 33.26,15.43 v38.29,15.43 | JP3.7 26.06,1.94 29.6,5.49 35.32,5.49 44.35,14.52 IN2.P1
  Bottom 0.305: v27.01,36.45 27.01,31.56 29.15,29.26 v29.15,25.03 | v38.29,15.43 39.78,13.95 43.78,13.95 44.35,14.52 IN2.P1
D5  (via drill 0.3)
  Top 0.305: v39.2,29.83 30.61,29.83 30.59,31.11 31.55,32 U1.9 | 44.61,29.83 43.32,29.83 | 43.32,29.83 v42.41,29.83 | R15.2 44.61,31.75 44.61,29.83 | v47.66,13.54 45.38,13.49 44.35,13.49 35.89,5.03 31.66,5.03 28.57,1.94 JP3.6 | v43.78,25.77 43.78,29.83 43.32,29.83 | 44.63,29.83 44.61,29.83
  Bottom 0.305: v42.41,29.83 v39.2,29.83 | v47.66,13.54 47.66,25.77 v43.78,25.77
D6  (via drill 0.3)
  Top 0.305: v32.23,33.26 32.23,32.12 U1.10 32.35,32 32.35,31.43 32.94,30.84 v33.08,30.94 | v32,14.29 32,7.77 v32.8,6.97 | v44.39,34.52 45.26,35.55 R12.2 | v41.02,31.89 41.02,30.31 42.75,28.57 v42.98,28.57
  Bottom 0.305: v32.23,33.26 31.18,33.26 30.96,33.18 30.96,31.11 30.64,31.11 30.64,26.06 30.7,26.06 32,24.92 v32,14.29 | v32.8,6.97 32.8,3.54 31.2,1.94 JP3.5 | v44.39,34.52 41.76,31.89 v41.02,31.89 | v42.98,28.57 42.75,28.57 41.83,27.66 36.01,27.66 33.72,29.95 v33.08,30.94
D7  (via drill 0.3)
  Top 0.305: U1.11 33.03,32.12 33.03,33.38 32.46,33.95 31.66,33.95 30.29,32.58 29.95,32.58 24.46,27.09 24.46,26.86 24.23,26.63 23.77,26.63 23.55,26.4 23.55,23.32 23.2,22.97 23.2,20.8 24.69,19.32 JP1.2 | v33.6,7.89 33.66,7.94 32.7,7.94 32.7,13.6 32.65,14.55 30.4,16.8 30.06,16.8 28.69,18.17 v28.69,20.23
  Bottom 0.305: v33.6,7.89 33.6,1.94 JP3.4 | v28.69,20.23 28.46,20.46 28.46,20.57 27.77,21.26 26.75,21.26 24.8,19.32 JP1.2
D8  (via drill 0.3)
  Top 0.305: v34.61,7.94 34.61,8.57 33.34,8.57 v33.34,13.34 | v31.27,30.48 32.38,30.48 32.38,30.32 33.84,30.32 | 33.81,30.48 33.84,30.32 | 33.84,30.32 U1.12
  Bottom 0.305: U8.DATA 13.14,5.49 12,5.49 9.83,3.31 7.09,3.31 6.86,3.09 6.86,0.69 7.09,0.46 34.75,0.46 JP3.3 36.2,4.45 34.61,4.45 v34.61,7.94 | v33.34,13.34 33.97,13.34 33.97,17.46 33.02,17.46 33.02,24.77 31.27,26.35 v31.27,30.48
D9  (via drill 0.3)
  Top 0.305: v34.75,30.52 34.75,32 U1.13 | R2.2 45.38,39.32 46.41,38.29 46.41,36.58 44.61,36.58 v44.63,36.67 | v43.02,36.04 42.39,35.4 41.59,35.4 41.59,33.02 41.91,32.7 43.97,32.7 v43.97,30.56
  Bottom 0.305: v34.75,30.52 34.75,29.6 36.23,28.12 41.6,28.12 43.89,30.4 v43.97,30.56 43.97,30.4 46.98,30.4 47.81,30.44 48.81,29.6 48.81,10.52 46.06,7.77 44.58,7.77 38.75,1.94 JP3.2 | v44.63,36.67 43.66,36.67 v43.02,36.04
D10_SS  (via drill 0.3)
  Top 0.305: v35.55,30.75 35.55,32 U1.14 | v48.12,29.38 48.12,32.46 48.81,33.15 48.81,41.03 45.89,43.9 | 45.89,43.9 41.38,43.9 41.38,47.55 JP5.8 | v40.96,38.06 40.96,39.12 45.89,43.9
  Bottom 0.305: RF1.SEL 37.03,29.26 v35.55,30.75 35.55,31.77 36.12,32.35 38.18,32.35 39.78,33.95 40.58,33.95 41.38,34.75 41.43,34.75 41.43,36.2 40.96,36.2 v40.96,38.06 | v48.12,29.38 45.95,29.38 RF2.NSS
D11_MOSI  (via drill 0.3)
  Top 0.305: v35.55,33.38 36.23,32.69 36.23,32.12 U1.15 36.35,32 36.35,31.43 37.26,30.52 v38.52,30.52 | v25.38,44.01 25.15,43.78 21.14,43.78 20,44.92 18.52,44.92 ICSP1.4 | v28,44.69 30.36,44.69 31.2,45.38 36.46,45.38 38.63,47.55 JP5.7 38.72,47.21 v38.73,43.38 | v48.12,40.8 v48.12,33.38
  Bottom 0.305: v35.55,33.38 37.03,33.38 RF1.SDI | v38.52,30.52 42.05,30.52 42.85,31.32 45.83,31.32 RF2.MOSI 45.95,31.43 46.18,31.43 v48.12,33.38 | v25.38,44.01 27.32,44.01 v28,44.69 | v48.12,40.8 48.12,41.38 46.11,43.38 v38.73,43.38
D12_MISO  (via drill 0.3)
  Top 0.305: v39.2,31.2 38.41,31.2 37.6,32 37.15,32 U1.16 37.03,32.23 37.03,33.26 v35.78,34.52 | v33.15,44.58 31.25,44.58 30.4,43.89 29.72,43.89 28.35,42.52 27.77,42.52 27.45,42.85 | 27.45,42.85 24,46.29 21.14,46.29 18.86,48.58 16.92,48.58 15.89,47.55 ICSP1.1 | v33.38,36.92 30.98,39.32 30.98,39.55 30.75,39.78 v25.15,39.78 | v23.34,42.86 27.45,42.86 27.45,42.85
  Bottom 0.305: v39.2,31.2 41.89,31.2 43.95,33.26 45.83,33.26 RF2.MISO | 24,39.78 24,31.2 22.17,29.38 21.14,29.38 RF1.SDO | v33.15,44.58 JP5.6 | v33.38,36.92 v35.78,34.52 | 24,39.78 v25.15,39.78 | 24,39.78 23.34,39.78 v23.34,42.86
D13_SCK  (via drill 0.3)
  Top 0.305: v38.63,31.89 38.63,33.49 U1.17 | 35.55,43.2 37.15,43.2 v39.09,41.26 | 35.55,43.2 v30.18,43.2 | v35.87,46.06 35.2,46.06 33.72,47.55 JP5.5 | v35.87,43.32 35.55,43.2
  Bottom 0.305: RF1.SCK 37.15,31.32 37.72,31.89 v38.63,31.89 39.36,31.89 42.79,35.32 | 42.79,35.32 45.83,35.32 RF2.SCK | v30.18,43.2 30.18,43.43 28,45.61 21.83,45.61 21.37,46.06 17.95,46.06 16.92,45.03 15.89,45.03 ICSP1.3 | v39.09,41.26 42.23,38.1 42.23,35.32 42.79,35.32 | v35.87,43.32 v35.87,46.06
GND  (via drill 0.3)
  Top 0.254: U9.2 25.08,22.55
  Top 0.305: 25.08,22.55 v25.08,24.13 | 22.63,12 22.73,12 U10.4
  Top 0.381: v36.35,17.6 36.58,17.83 37.49,17.83 U4.2 | 33.6,22.75 34.63,23.77 34.63,24.46 35.66,25.49 35.66,25.83 C11.1 35.89,25.95 36.8,26.86 36.8,28.23 36.46,28.57 32.35,28.57 31.55,27.77 30.4,27.77 C9.2 | 33.6,22.75 33.15,22.29 33.15,22.06 R8.1 | 33.6,22.75 v34.29,22.06 | 42.8,33.72 45.38,33.72 LED4.MINUS 45.61,33.6 46.29,32.92 46.29,30.98 45.61,30.29 45.61,29.95 LED5.MINUS 45.61,29.72 46.35,28.92 46.35,25.4 47.78,25.4 47.78,16.92 46.41,16.92 45.38,15.89 43.55,15.89 42.72,15.06 | 42.8,33.72 42.75,33.72 C3.2 | U1.3 29.95,37.49 29.03,37.49 28.8,37.26 28.8,36.35 29.15,36.01 29.95,36.01 U1.5 30.06,36.01 36.92,36.01 37.03,36.12 | 43.86,37.49 43.81,37.81 43.81,38.77 C5.2 41.81,38.76 41.81,36.8 38.63,36.8 U1.21 38.41,36.69 37.6,36.69 37.03,36.12 | 43.86,37.49 44.46,37.49 | 44.46,37.49 45.49,37.49 LED3.MINUS | 44.46,37.49 44.46,40.23 LED2.MINUS 45.61,41.38 45.72,41.49 v45.72,42.63 | v37.26,36.01 37.15,36.01 37.03,36.12 | 42.8,33.72 42.8,34.5 43.02,34.5 43.02,34.45 43.86,35.32 43.86,37.49 | v40.35,13.14 40.8,13.14 v42.41,14.74 | 7.54,28.23 7.54,29.26 7.32,29.49 U2.2 | 7.54,28.23 7.54,26.98 C14.2 | 7.54,28.23 2.29,28.23 2.06,28 CN4.1 | 7.09,20 6.86,20.23 5.71,20.23 IN4.P2 | 7.09,20 9.26,17.83 9.26,11.54 8.91,11.2 7.66,11.2 CN1.GND | C2.2 C7.2 8.46,34.4 8.46,35.09 8.23,35.32 | 8.23,35.32 7.77,35.78 7.77,37.72 6.74,38.75 R4.1 6.86,38.86 6.86,41.26 7.43,41.83 v10.06,41.83 | v8.46,35.55 8.23,35.32 | 22.7,38.98 21.14,38.98 v19.43,40.69 | 22.7,38.98 24.12,38.98 C6.2 | U6.3 12.12,9.6 11.89,9.6 8.23,5.94 8.23,5.6 U8.GND 8.23,5.49 8.23,4.46 | 8.23,4.46 8.23,1.94 JP3.14 | 17.14,28.8 17.14,29.72 17.37,29.95 R5.1 17.6,30.06 20.12,30.06
  Top 0.381: 17.14,28.8 C4.2 | v17.03,28.8 17.14,28.8 | 20.12,30.06 22.17,32.12 22.17,32.35 22.86,33.03 22.75,33.15 v22.73,32.99 | 23.64,33.6 X1.2 | 21.26,6.74 22.17,6.74 R20.1 22.4,6.74 24.69,6.74 R22.1 24.92,6.86 26.52,8.46 27.2,8.46 C16.2 | 21.26,6.74 19.77,6.74 R19.1 19.55,6.86 19.09,7.32 | 22.63,12 21.26,10.63 21.26,8.57 | 21.26,6.74 21.26,8.57 | v21.14,8.57 21.26,8.57 | 19.43,16.46 19.09,16.8 18.52,16.8 C15.2 | 19.43,16.46 19.77,16.12 19.77,14.4 18.4,13.03 C12.2 18.52,12.92 18.52,7.89 19.09,7.32 | 19.43,16.46 22.17,19.2 JP1.3 | U5.7 13.49,17.26 14.86,17.26 U5.GND 15.09,17.26 15.32,17.26 18.63,20.57 18.97,20.57 19.89,21.49 R11.1 | 18.63,24.12 13.95,24.12 12.92,25.15 12.12,25.15 R18.1 12.12,25.03 7.09,20 | 18.63,24.12 19.66,25.15 C13.2 | 18.63,24.12 19.89,22.86 19.89,21.6 R11.1 | 21.14,21.83 22.52,23.2 v22.52,24.13 22.52,25.49 U3.1 22.52,25.72 22.52,26.18 20.23,28.46 20.23,29.95 20.12,30.06 | 21.14,21.83 20,21.83 R11.1 | 21.14,21.83 22.17,20.8 22.17,19.43 JP1.3 | 8.23,4.46 16.23,4.46 19.09,7.32 | v22.7,37.62 22.7,38.98 | v27.89,17.14 30.98,14.06 30.98,7.66 32.46,6.17 35.09,6.17 37.49,8.57 37.49,9.53 37.49,9.72 36.23,10.97 36.23,11.66 M1.2 | v24.57,16.34 24.35,16.34 21.95,18.75 JP1.3
  Top 0.406: v38.1,9.53 37.49,9.53 | v42.41,14.74 42.72,15.06 | v40.48,19.68 40.48,20.16 v38.58,20.16 | 23.64,33.6 22.81,34.24 22.81,36.04 25.72,36.04 25.72,35.56 27.78,35.56 27.78,36.04 28.8,36.04 28.8,36.35
  Bottom 0.305: v25.08,24.13 v22.52,24.13 | 36.19,20.16
  Bottom 0.381: 36.35,13.14 36.35,11.89 36.23,11.77 M1.2 | 36.35,13.14 v36.35,17.6 36.23,17.72 | 36.19,20.16 36.23,20.12 | 45.83,41.38 RF2.GND 45.72,41.49 v45.72,42.63 | v37.26,36.01 37.15,36.12 37.15,37.26 RF1.GND | v40.35,13.14 36.35,13.14 | CN4.1 2.06,27.89 2.06,26.52 3.77,24.8 3.77,21.72 5.14,20.34 5.71,20.34 IN4.P2 | v8.46,35.55 8.8,35.2 9.49,35.2 C17.2 | v19.43,40.69 19.43,41.49 18.52,42.41 ICSP1.6 17.46,43.69 14.8,43.69 14.9,43.74 11.81,43.74 v10.06,41.83 | v17.03,28.8 15.89,29.95 15.89,33.38 R24.1 | v21.14,8.57 22.17,9.6 22.75,9.6 CN3.2 | v22.73,32.99 22.7,32.99 v22.7,37.62 | v27.89,17.14 25.72,17.14 24.92,16.34 v24.57,16.34
  Bottom 0.406: 36.23,20.12 36.23,17.72 | v34.29,22.06 36.19,20.16 | LINK1.3 40.64,8.26 38.1,8.26 v38.1,9.53 | LINK2.3 v42.41,14.73 v42.41,14.74 | LINK3.3 40.48,20.78 v40.48,19.68 | v38.58,20.16 36.19,20.16
N$1
  Top 0.305: U1.7 29.95,34.4 25.26,34.4 24.92,34.75 24.23,34.75 X1.1
N$2
  Top 0.305: LED2.PLUS 47.21,39.55 47.32,39.43 R2.1
N$3
  Bottom 0.305: U$1.P$1 48.58,42.75 48.81,42.52 48.81,40.58 47.66,39.43 45.95,39.43 RF2.ANA 45.72,39.43 45.49,39.43 42.98,41.95 38.86,41.95 38.29,41.38 37.15,41.38 RF1.ANT
N$4
  Top 0.305: LED1.PLUS 21.26,37.38 21.26,34.52 R3.2
N$5  (via drill 0.3)
  Top 0.305: v41.95,20.8 41.95,21.49 38.18,25.26 38.18,25.83 R6.1 | v28.46,26.63 28,27.09 28,27.55 C8.1 | v30.29,17.49 30.52,17.26 30.63,17.26 34.18,13.72 34.18,10.74 35.66,9.26 36.12,9.26 M1.1
  Bottom 0.305: v41.95,20.8 44.35,18.4 45.38,18.4 45.72,18.06 45.72,13.83 44.58,12.69 40.92,12.69 39.66,11.43 38.41,11.43 36.23,9.26 M1.1 | v28.46,26.63 28.46,23.2 30.52,21.14 30.52,19.09 30.29,18.86 v30.29,17.49
N$6  (via drill 0.3)
  Top 0.305: 34.98,21.14 34.98,21.26 35.66,21.95 R9.1 35.78,22.17 37.38,23.77 38.06,23.77 R10.2 | 34.98,21.14 34.98,18.86 U4.4 | v31.32,24.69 32.46,25.83 33.03,25.83 C10.1 | v31.32,21.26 32.23,21.26 32.35,21.14 34.98,21.14
  Bottom 0.305: v31.32,21.26 v31.32,24.69
N$7  (via drill 0.3)
  Top 0.305: v34.98,22.97 34.98,23.09 35.66,23.77 R9.2 | v32.02,26.72 31.32,26.72 31.09,26.63 29.38,26.63 28.57,25.83 28,25.83 C8.2
  Bottom 0.305: v32.02,26.72 33.5,25.4 33.5,22.97 v34.98,22.97
N$8
  Top 0.305: R7.1 31.32,22.06 33.03,23.77 R8.2 | U4.3 37.49,18.75 36.23,18.75 35.66,18.17 33.49,18.17 30.63,21.03 30.63,21.95 R7.1 | C9.1 30.29,25.83 30.29,25.26 29.49,24.46 29.49,22.97 30.29,22.17 R7.1
N$9
  Top 0.305: U6.2 12.23,10.97 12.8,11.54 12.92,11.54 13.6,12.23 13.6,13.95 15.32,15.66 16,15.66 16.92,16.57 16.92,17.72 17.83,18.63 18.4,18.63 C15.1
N$10
  Top 0.305: LED3.PLUS 47.21,37.38 47.21,35.78 47.32,35.66 R12.1
N$11
  Top 0.305: LED4.PLUS 47.21,33.6 47.21,31.89 47.32,31.77 R15.1
N$12
  Top 0.305: LED5.PLUS 47.21,28.12 47.32,28 R16.1
N$13
  Bottom 0.381: LINK1.2 40.69,9.94 42.86,9.94 44.35,11.43 IN1.P2
N$14
  Bottom 0.305: R24.2 15.77,35.09 14.4,35.09 12.8,33.49 R25.1 12.69,33.38 11.77,32.62 9.56,32.62 9.6,33.38 C17.1 9.37,33.49 7.66,35.2 7.66,36.12 6,37.78 | 6,37.78 7.32,39.09 U$2.TIP | 6,37.78 5.03,36.8 5.03,34.98 6.29,34.99 6.29,35.08 R23.1
N$15
  Bottom 0.381: LINK2.2 40.69,15.54 42.75,15.54 44.35,17.14 IN2.P2
N$16
  Top 0.406: U10.5 24.77,11.1 R22.2
N$17
  Top 0.305: R20.2 22.29,8.57 22.29,10.74 24,12.46 24,12.8 24.8,13.6 26.75,13.6 U10.6
N$18  (via drill 0.3)
  Top 0.305: v23.2,16.34 23.09,16.46 21.49,16.46 21.03,16 21.03,14.74 19.77,13.49 19.77,8.57 R19.2 | v24.69,17.26 25.38,16.57 25.38,15.77 24.8,15.2 24.8,14.74 25.26,14.29 26.75,14.29 U10.7
  Bottom 0.305: v23.2,16.34 23.55,16.34 24.46,17.26 v24.69,17.26
N$19
  Bottom 0.381: LINK3.2 40.69,21.6 43.09,21.6 44.35,22.86 IN3.P2
N$20
  Top 0.305: C1.2 18.52,34.52 18.52,34.98 20.34,36.8 20.34,38.27 20.32,38.58 18.57,40.58 15.43,40.58 13.83,38.98 13.37,38.98 12.66,39.53 12.66,41.81 12.68,43.55 6.5,43.55 3.65,40.69 CN4.6
N$21
  Top 0.305: U1.8 29.95,33.49 28.85,33.49 27.82,32.46 24.23,32.46 X1.3
PROG
  Top 0.305: R4.2 6.74,37.03 6.74,35.89 7.54,35.09 7.54,33.26 6.4,32.12 U2.5
PWR  (via drill 0.3)
  Top 0.381: C7.1 3.43,34.29 2.06,32.92 CN4.3 | v17.95,37.9 17.95,37.6 17.26,36.92 Q1.2 | v13.79,35.55 13.83,35.2 C2.1 | R17.2 9.83,26.98 9.83,31.09 12.92,34.18 C2.1 | v23.2,31.43 23.43,31.2 23.43,27.77 U3.3 | C2.1 12.8,34.4 9.83,37.38 8.91,37.38 D1.C 8.8,37.6 7.66,38.75 v7.66,40.92 | JP1.1 27.2,19.2 27.2,17.6 27.09,17.49 27.09,16.34 29.38,14.06 29.38,7.09 26.18,3.89 16.57,3.89 16,3.31 12.12,3.31 10.74,1.94 JP3.13
  Bottom 0.381: v13.79,35.55 15.66,37.38 15.66,37.72 16.69,38.75 17.37,38.75 17.95,38.18 v17.95,37.9 17.83,37.95 17.83,36.46 18.29,36.01 18.63,36.01 v23.2,31.43 | v7.66,40.92 5.83,40.92 3.89,38.98 3.89,34.75 3.2,34.06 3.09,34.06 2.06,33.03 CN4.3 2.17,32.92 4.46,30.63 4.46,21.95 4.8,21.6 6.63,21.6 9.49,18.75 9.49,10.86 14.4,5.94 14.4,5.14 12.57,3.31 12.12,3.31 10.74,1.94 JP3.13
RST  (via drill 0.3)
  Top 0.305: 16.92,34.4 15.77,34.4 R1.2 | 16.92,34.4 18.4,32.92 C1.1 | 22.52,42.06 20.46,42.06 18.86,43.66 17.03,43.66 15.89,42.52 ICSP1.5 | 22.52,42.06 29.21,42.06 29.21,42.55 32.7,42.55 33.85,41.42 33.83,41.26 33.83,40.69 U1.29 | 16.92,34.4 16.92,35.09 v18.63,36.8 | v22.52,42.18 22.52,42.06
  Bottom 0.305: v18.63,36.8 18.73,36.83 18.73,38.31 22.52,38.31 v22.52,42.18
STAT  (via drill 0.3)
  Top 0.305: v18.1,39.89 18.1,38.89 19.55,37.49 LED1.MINUS | v4.57,31.66 4.57,31.32 6.29,29.6 U2.1
  Bottom 0.305: v18.1,39.89 14.29,39.89 13.83,40.35 11.66,40.35 11.09,39.78 9.14,39.78 8.8,40.12 5.94,40.12 4.57,38.75 v4.57,31.66
VBAT  (via drill 0.3)
  Top 0.305: 12.8,28 14.06,29.26 14.06,30.86 14.47,31.43 14.47,33.71 14.53,33.83 14.53,37.49 15.89,38.86 16.23,38.86 Q1.3 | 12.8,28 10.86,28 v10.63,28.23 | v8.46,28.35 8.46,29.38 8.34,29.49 U2.3 | v13.83,20.34 v15.2,18.97 | v13.6,26.63 13.6,27.09 12.8,27.89 12.8,28
  Bottom 0.305: v10.63,28.23 8.57,28.23 v8.46,28.35 | v15.2,18.97 15.09,18.97 11.77,15.66 11.77,15.2 15.2,11.77 22.75,11.77 CN3.1 | v13.83,20.34 13.83,26.4 v13.6,26.63
VBUS  (via drill 0.3)
  Top 0.381: 16.8,37.95 15.77,36.92 15.43,36.92 Q1.1 | C6.1 24.12,37.15 24.12,36.69 22.15,36.69 22.15,33.67 21.26,32.76 R3.1 21.14,32.92 20.8,33.26 v20.12,33.26 20,33.15 20,32.69 19.09,31.77 17.37,31.77 15.66,30.06 R5.2 | v8.23,30.75 8.23,32 U2.4 | IN4.P1 4.46,21.6 4.46,16.8 6.86,14.4 7.54,14.4 CN1.VBUS
  Top 0.406: 16.8,37.95 v17.03,37.95 17.03,38.1 17.3,38.42 17.3,39.95 15.72,39.95 D1.A
  Bottom 0.381: v17.03,37.95 17.03,36.35 v20.12,33.26 20,33.15 20,32.46 17.83,30.29 17.83,28.46 16.8,27.43 8.23,27.43 7.32,28.35 | v8.23,30.75 8.23,29.26 7.32,28.35 | 7.32,28.35 5.6,26.63 5.6,22.97 IN4.P1

### Text on the board
tNames: A2 | A3 | A4 | A5 | 13 | 12 | 11 | 10 | RH003.1 / Nov 2014 | SDA | SCL | SK | MI | MO | SS | ANT | GRN | Sensor Node / Richard Hawthorn / richardhawthorn.com | Charging | FTDI | BLK | 5v in | TMP102 | + | - | IN3 | IN2 | IN1 | RX | TX | ~ | ~ | ~ | ~ | GND | VIN | 3.3 | 0 | 1 | 2 | 3 | 4 | 5 | 6 | 7 | 8 | 9 | A1
bNames: gnd vcc | gnd vcc | gnd vcc
tDocu: REG